# Altium schematic sheet Zasilanie.SchDoc: Płytka rozwojowa STM
size A4; Author1: Łukasz Wawrzyniak; Organization: Politechnika Łódzka; Address1: WEEIA; Address2: Elektronika i Telekomunikacja; Address3: Semestr zimowy 2021/2022; Address4: Stopień II; Revision: -; SheetNumber: 2; SheetTotal: 7; Author2: Mateusz Melka; Title2: Zaawansowane narzędzia CAD/EDA; Author5: Maciej Figiel; Author4: Michał Skurpel; Author3: Jakub Korzeniowski; Index1: 239499; Index2: 239488; Index3: 239436; Index4: 239457; Index5: 239473
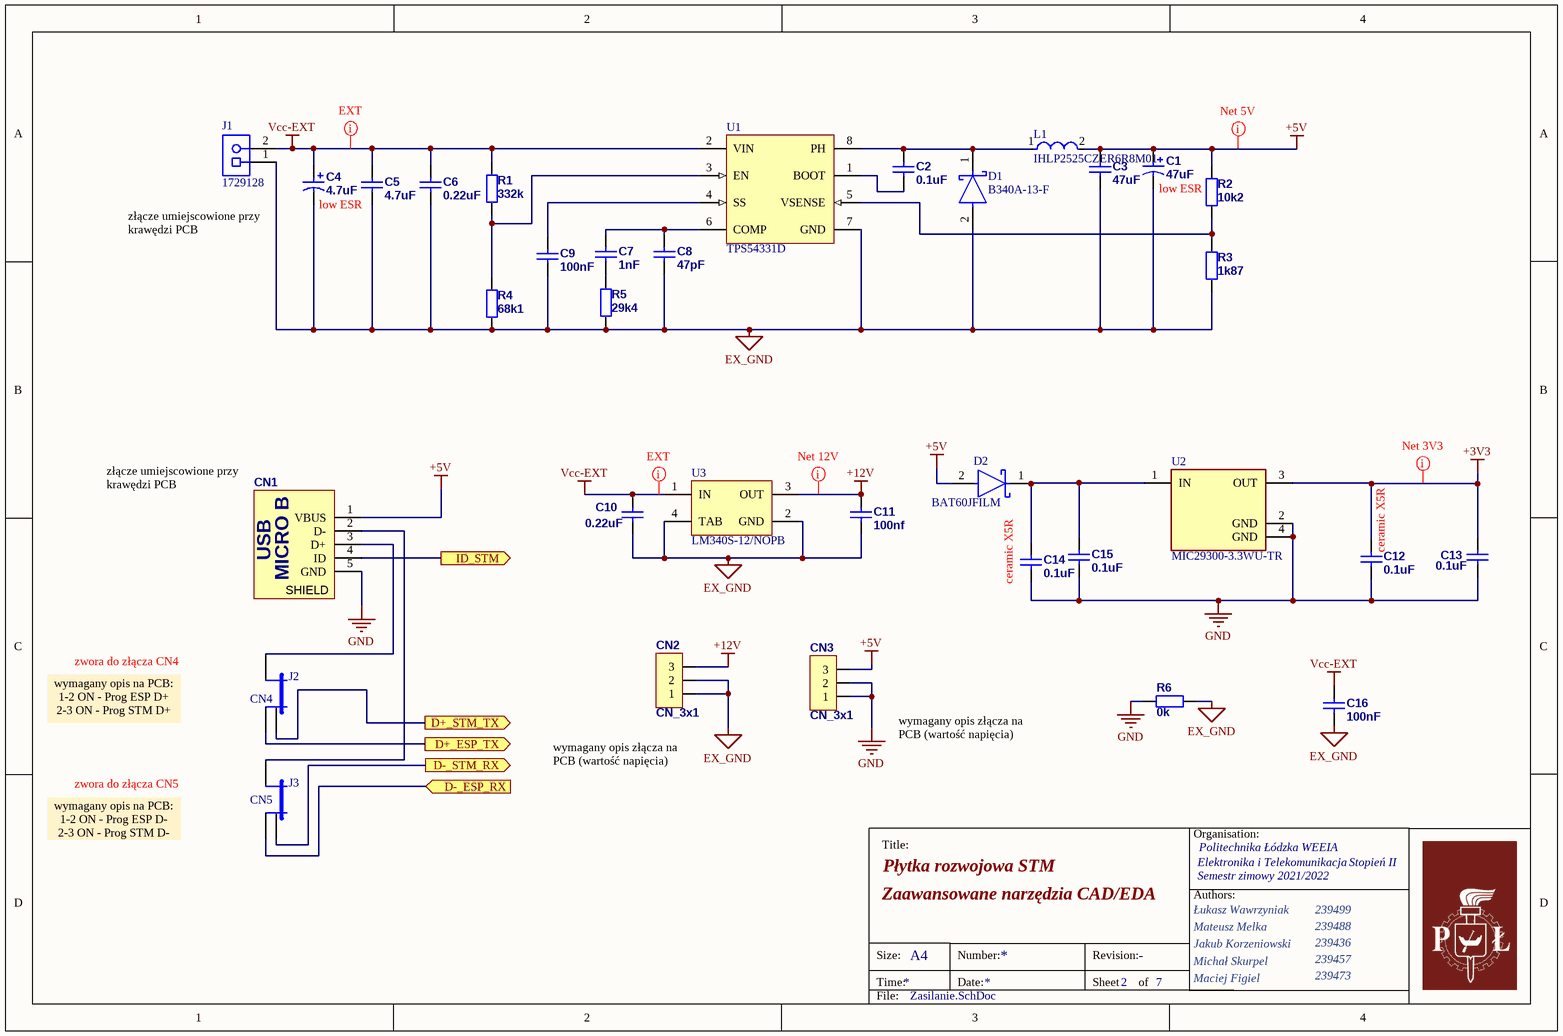
[diagram p0: Zasilanie.SchDoc]

## Parts
C1  value 47uF  [CES_C_5.3x5.3_5.4]
C2  value 0.1uF  [0805]
C3  value 47uF  [0805]
C4  value 4.7uF  [CES_C_5.3x5.3_5.4]
C5  value 4.7uF  [0805]
C6  value 0.22uF  [C1206]  (hidden comment: Cap)
C7  value 1nF  [0805]
C8  value 47pF  [0805]
C9  value 100nF  [0805]
C10  value 0.22uF  [0805]
C11  value 100nf  [0805]
C12  value 0.1uF  [0805]  (hidden comment: 10uF)
C13  value 0.1uF  [0805]  (hidden comment: 100n)
C14  value 0.1uF  [0805]  (hidden comment: 1uF)
C15  value 0.1uF  [0805]  (hidden comment: 100n)
C16  value 100nF  [0805]
CN1  473460001  [473460001]  (value not drawn)
CN2  CN_3x1  [GP_3x1_2mm]
CN3  CN_3x1  [GP_3x1_2mm]
D1  B340A-13-F  [FP-SMA-MFG]
D2  BAT60JFILM  [FP-BAT60JFILM-MFG]
J1  1729128  [PHOE-1729128-2_V]
J2  CN4  [Jumper_1x3_Raster_2_54mm]
J3  CN5  [Jumper_1x3_Raster_2_54mm]
L1  IHLP2525CZER6R8M01  [FP-IHLP-2525CZ-FP_2_413x3-MFG]
R1  value 332k  [0805]
R2  value 10k2  [0805]
R3  value 1k87  [0805]
R4  value 68k1  [0805]
R5  value 29k4  [0805]
R6  value 0k  [0805]
U1  TPS54331D  [D0008A_M]
U2  MIC29300-3.3WU-TR  [FP-TO263-3LD-PL-1-MFG]
U3  LM340S-12/NOPB  [KTT0003B_N]

## Ports
D+_ESP_TX (out), D+_STM_TX (out), D-_ESP_RX (in), D-_STM_RX (out), ID_STM (out)

## Nets
+3V3: C12.2 C13.2 U2.3(OUT)
+5V: C1.1 C3.2 CN1.1(VBUS) CN3.3 D2.2(A) L1.2 R2.2
+12V: C11.2 CN2.3 U3.3(OUT)
EX_GND: C1.2 C3.1 C4.2 C5.1 C6.1 C8.1 C9.1 C10.1 C11.1 C16.1 CN2.1 CN2.2 D1.2(A) J1.1 R3.1 R4.1 R5.1 R6.1 U1.7(GND) U3.2(GND) U3.4(TAB)
GND: C12.1 C13.1 C14.1 C15.1 CN1.5(GND) CN3.1 CN3.2 R6.2 U2.2(GND) U2.4(GND)
Vcc-EXT: C4.1 C5.2 C6.2 C10.2 C16.2 J1.2 R1.2 U1.2(VIN) U3.1(IN)
D+_ESP_TX: J2.3 ; port D+_ESP_TX
D+_STM_TX: J2.1 ; port D+_STM_TX
D-_ESP_RX: J3.3 ; port D-_ESP_RX
D-_STM_RX: J3.1 ; port D-_STM_RX
ID_STM: CN1.4(ID) ; port ID_STM
NetC2_1: C2.1 U1.1(BOOT)
NetC2_2: C2.2 D1.1(C) L1.1 U1.8(PH)
NetC7_1: C7.1 R5.2
NetC7_2: C7.2 C8.2 U1.6(COMP)
NetC9_2: C9.2 U1.4(SS)
NetC14_2: C14.2 C15.2 D2.1(K) U2.1(IN)
NetCN1_2: CN1.2(D-) J3.2
NetCN1_3: CN1.3(D+) J2.2
NetR1_1: R1.1 R4.2 U1.3(EN)
NetR2_1: R2.1 R3.2 U1.5(VSENSE)

Not connected (* = marked no-connect by the designer): CN1 S(SHIELD)

## Layout directives
net class Supply5V: +5V
net class Supply3V3: +3V3
net class Supply12V: +12V
net class SupplyEXT: Vcc-EXT

## Notes on the sheet
- low ESR
- złącze umiejscowione przy krawędzi PCB
- (near C14) ceramic X5R
- (near C12) ceramic X5R
- wymagany opis na PCB:
  1-2 ON - Prog ESP D+
  2-3 ON - Prog STM D+
- zwora do złącza CN4
- zwora do złącza CN5
- (near CN2) wymagany opis złącza na PCB (wartość napięcia)
- wymagany opis złącza na PCB (wartość napięcia)
- wymagany opis na PCB:
  1-2 ON - Prog ESP D-
  2-3 ON - Prog STM D-
- Title:
- Organisation:
- Authors:
- Size:
- Time:
- A4
- Number:
- Date:
- Revision:
- Sheet
- of
- File:
- (in symbol 473460001) USB; MICRO B

## Library data of the parts
C1 C4 = Cap Pol: Polarized Capacitor SMD low ESR ±1%; ComponentLink1Description: datasheet; ComponentLink2Description: supplier
C2 C3 C5-C10 C12-C15 = Cap: Ceramic capacitor MLCC SMD ±5%; ComponentLink1Description: datasheet; ComponentLink2Description: supplier
C11 = Cap: Ceramic capacitor MLCC SMD ±5%; Voltage: 100VDC; ComponentLink1Description: datasheet; ComponentLink2Description: supplier
C16 = Cap: Ceramic capacitor MLCC SMD ±1%; Voltage: 100VDC; ComponentLink1Description: datasheet; ComponentLink2Description: supplier
CN1 = 473460001: Molex 473460001 microUSB Connector; Published: 20-Mar-2006; Supplier 1: Farnell; Supplier 2: TME; Supplier Part Number 1: 2426321; Supplier Part Number 2: MX-47346-0001; Shop link: TME: @MX-105017-0001
CN2 CN3 = CN_3x1: Goldpin type: male 2.54mm
D1 = CMP-1667-00003-3: DIODE SCHOTTKY 40V 3A SMA; Peak Non-Repetitive Surge Current: 80A; Polarity: Standard; Capacitance: 250pF; Forward Voltage: 500mV; Element Configuration: Single; Max Reverse Current: 500uA; Length: 4.6mm; Number of Pins: 2; Contact Plating: Tin; Min Operating Temperature: -55°C; Package Quantity: 5000; Max Reverse Voltage (DC): 40V; REACH SVHC: No SVHC; Voltage Rating (DC): 40V; Max Forward Surge Current (Ifsm): 80A; Average Rectified Current: 3A; Forward Current: 3A; Output Current: 3A; Height: 2.3mm; Current Rating: 3A; Voltage: 40V; Max Operating Temperature: 125°C; Packaging: Tape and Reel; Current: 3A; Termination: SMD/SMT; Radiation Hardening: No; Case/Package: SMA; Width: 2.92mm; Max Repetitive Reverse Voltage (Vrrm): 40V; Mount: Surface Mount; Weight: 0.002258oz; Lead Free: Lead Free; Series: -; RoHS Compliant: Yes
D2 = CMP-12187-000028-1: DIODE SCHOTTKY 10V 3A SOD323; Max Forward Surge Current (Ifsm): 5A; Forward Voltage: 580mV; Max Reverse Leakage Current: 7.5uA; Element Configuration: Single; Polarity: Standard; Contact Plating: Tin; Package Quantity: 1; Mount: Surface Mount; Min Operating Temperature: -65°C; Average Rectified Current: 3A; Packaging: Tape and Reel; Forward Current: 3A; Height: 1.07mm; Length: 1.8mm; REACH SVHC: No SVHC; Peak Non-Repetitive Surge Current: 5A; Max Surge Current: 5A; Width: 1.45mm; Current Rating: 3A; Lead Free: Lead Free; Radiation Hardening: No; Max Reverse Voltage (DC): 10V; Peak Reverse Current: 7.5uA; Max Operating Temperature: 150°C; Max Repetitive Reverse Voltage (Vrrm): 10V; Number of Pins: 2; Weight: 0.01lb; Output Current: 3A; Voltage Rating (DC): 10V
J1 = CMP-2000-05815-1: PCB Terminal Block, 13.5 A, 400 V, 2-Pin THD, RoHS, Bulk; Manufacturer: Phoenix Contact; Package Version: 03/2015; No. of Rows: 1; Pitch: 5.08mm; No. of Positions: 2; Current Rating: 13500mA; Voltage Rating: 400V; Manufacturer URL: http://www.phoenixcontact.com/; Datasheet URL: https://datasheet.ciiva.com/16046/1729128-16046181.pdf; RoHS: TRUE; Package URL: https://www.phoenixcontact.com/online/portal/pi/pxc/product_detail_page/!ut/p/b1/3VdJjqNKFDxLH8AFycySyWY2ozFsEPOMMQaDOX1XedGL_1Vdm5YXJleknhSKeBkvI6EA8ncAo3AYoDhBQGco6KN7VURTdemj9us_IEKEZo_YHiPAEWEFmDGOHMORkqKYCORBZxgL7ZoaZYcbFFUZ3fqxSY6GOuxydWUuHqz1ynmMFygu583Bob0Ewr6Sd_l-5m-kAueHiB0jpRwZwe58wwtkpxtMYd_LmGcDRU02dRNEyWt6Y2ti5pSyJ_reIkzIulrqApdnbT11V5jnCKbYNCvhEM1MCpPByat_X379-iThf08CI5GfOPqfBeS3BRoBOdD55AKVv0iLwCMq-2BrzXWSGRH7pUGD9uwXQjiph3xL0DKQwdGa0JImiIOmBNOestqgwTHSSs2oOep-78apyXQBvNi8ZLaFjvjWvcaUEBu0MC6Wbe-d6mB0FAebo2lUWinqYaZs5DAYzV0RP9yitUjnGJ0iI9xhZkT42OCQNUJJhkgWINNQLP2JFP6OpMg3JCVg70jqHT0lvKOnhHf0lPuOnnLf0VPuWx6_dxwUIvwk5WMkT0kLL1mh61l2yZVSzG3pYV_bqo-mj6uMKwKwdnnW8Jh5RTOJzMOA5c-eJDaZQw4mTMPH02PvS_ZAqNVjVTo2WyYLkwH_KU1mmmG5kjRhDqPXLwwVHvVOjCM60-fpXvTDfMGW1PVFVS1r4e4yVDk4ZdNbkUHvqPqQSeian4UD39fNKmachqdJ1NJbyk8rXT9mXTvPk3oE5meulKGgiruPJek-4I9hTT6G8ZLOyRSm2RRVbThERQad5OS28hdt4YW4vG0stgYYzsWsK4_7y6DZMjJSCqri1kyiZR5vD7pwIrNR7QwPHTcLTI5qT7eRlpHrdGiupYlqQDJ7zy_CND8fWWBoLRXxk1RVcXiBQwbTD4Xi7KL-FuO94t9xaqweXzH; PartNumber: 1729128; Package Description: 2-Pin Through Hole Device, Body 8.1 x 10.16 mm, Pitch 5.08 mm; Datasheet Version: 12/2013; Mounting Technology: ThroughHole; Orientation: Horizontal; Package Reference: 1729128-2; Packing: Bulk
J2 J3 = Jumper1x3
L1 = CMP-02424-000104-1: Commercial Inductors, High Saturation Series 6.8uH 4.5A 60mΩ 20%; Saturation Current: 8A; Self Resonant Frequency: 5MHz; Core Material: Metal; DC Resistance (DCR): 60mR; Test Frequency: 100kHz; Shielding: Shielded; Number of Pins: 2; Tolerance: 20%; Max DC Current: 8A; Max Operating Temperature: 125°C; Radiation Hardening: No; Inductance: 6.8uH; Contact Plating: Tin; RMS Current (Irms): 4.5A; Case/Package: 2525; Inductance Tolerance: 20%; Case Code (Metric): 6363; Lead Free: Lead Free; Package Quantity: 2000; Current Rating: 4.5A; Case Code (Imperial): 2525; Height - Seated (Max): 0.118inch; Height: 3mm; Mount: Surface Mount; Depth: 6.72mm; Military Standard: Not; Packaging: Tape and Reel; Min Operating Temperature: -55°C; Width: 0.255inch; Length: 7.24mm; Termination: SMD/SMT
R1-R5 = Res: Resistor SMD  ±1%; Published: 19-Feb-2006; ComponentLink1Description: datasheet; ComponentLink2Description: supplier
R6 = Res: Resistor SMD  ±5%; Published: 19-Feb-2006; ComponentLink1Description: datasheet; ComponentLink2Description: supplier
U1 = CMP-0323-00203-3: Buck Step Down Regulator with 3.5 to 28 V Input and 0.8 to 25 V Output, -40 to 150 degC, 8-Pin SOIC (D), Green (RoHS & no Sb/Br); Manufacturer: Texas Instruments; Regulated Outputs(#): 1; Vout(Min)(V): 0.8; Iout(Max)(A): 3; Vin(Min)(V): 3.5; Rating: Catalog; SubFamily: Step-Down Regulator; Vout(Max)(V): 25; Iq(Typ)(mA): 0.11; Vin(Max)(V): 28; Duty Cycle(Max)(%): 90; ComponentLink3Description: URL Link1; ComponentLink1URL: http://www.ti.com/general/docs/lit/getliterature.tsp?genericPartNumber=TPS54331&fileType=pdf; Code_JEDEC: MS-012AA; PartNumber: TPS54331D; PackageVersion: revM, Jun-2011; ComponentLink1Description: Datasheet; PackageReference: D0008A; Eco-Plan: Green (RoHS & no Sb/Br); PackageDescription: 8-Pin Plastic Small Outline Integrated Circuit, 4.9 x 3.9 mm, Pitch 1.27 mm Pitch; ComponentLink2URL: http://www.ti.com/litv/pdf/msoi002j; DatasheetVersion: SLVS839D; Topology: Buck; Switch Current Limit(Typ)(A): 3.5; ComponentLink3URL: Samples URL:http://www.ti.com/product/tps54331#samples; ComponentLink2Description: Package Specification; Mounting Technology: Surface Mount
U2 = CMP-06324-000026-1: IC REG LINEAR 3.3V 3A TO263-3; Dropout Voltage: 370mV; Number of Regulators: 1; Case/Package: TO-263-4; Lead Free: Lead Free; Min Operating Temperature: -40°C; Mount: Surface Mount; Packaging: Tape and Reel; Output Voltage: 3.3V; Max Operating Temperature: 125°C; Output Current: 3A
U3 = CMP-0062-00646-4: Series 3-Terminal Positive Regulators, 3-pin TO-263, Pb-Free; Manufacturer: Texas Instruments; PackageTopMarking: NSUZXYTTE#*LM340S*-12 P+; CompType: LDO IC; PowerWise: N; RoHS: Y; PackageDescription: TO-263, Molded, .400 x .390 x .180in, 3 Lead, .1in Pitch, Surface Mount; ComponentLink1URL: http://www.ti.com/general/docs/lit/getliterature.tsp?genericPartNumber=LM340&fileType=pdf; PinCount: 3; ComponentLink1Description: Datasheet URL; Code_JEDEC: MO-169-AA; PackageReference: KTT0003B